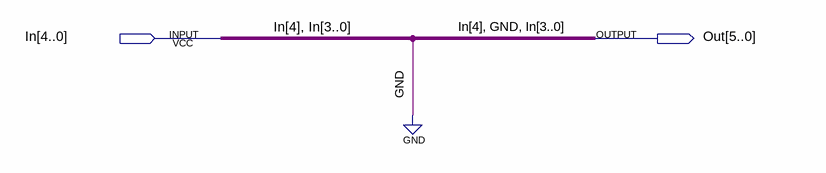
[diagram p0: schematic sheet]
// Quartus schematic bit_extensor.bdf as structural Verilog: 0 symbols, 2 pins
module bit_extensor (
  input  [4:0] In,
  output [5:0] Out
);


  assign Out = {In[4], 1'b0, In[3:0]};
endmodule
